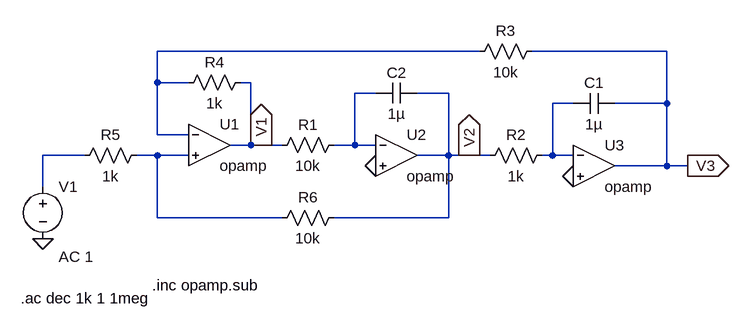
[diagram p0: schematic EJE8.asc]
EJE8.asc, the LTspice schematic file:
Version 4
SHEET 1 952 680
WIRE 544 -32 48 -32
WIRE 832 -32 624 -32
WIRE 48 16 48 -32
WIRE 96 16 48 16
WIRE 192 16 176 16
WIRE 384 32 352 32
WIRE 496 32 448 32
WIRE 688 48 656 48
WIRE 832 48 832 -32
WIRE 832 48 752 48
WIRE 48 96 48 16
WIRE 96 96 48 96
WIRE 192 112 192 16
WIRE 192 112 160 112
WIRE 208 112 192 112
WIRE 240 112 208 112
WIRE 352 112 352 32
WIRE 352 112 320 112
WIRE 384 112 352 112
WIRE -64 128 -128 128
WIRE 48 128 16 128
WIRE 96 128 48 128
WIRE 496 128 496 32
WIRE 496 128 448 128
WIRE 528 128 496 128
WIRE 560 128 528 128
WIRE 656 128 656 48
WIRE 656 128 640 128
WIRE 688 128 656 128
WIRE 832 144 832 48
WIRE 832 144 752 144
WIRE 864 144 832 144
WIRE -128 176 -128 128
WIRE 48 224 48 128
WIRE 240 224 48 224
WIRE 496 224 496 128
WIRE 496 224 320 224
FLAG 384 144 0
FLAG 688 160 0
FLAG 208 112 V1
IOPIN 208 112 Out
FLAG 528 128 V2
IOPIN 528 128 Out
FLAG 864 144 V3
IOPIN 864 144 Out
FLAG -128 256 0
SYMBOL res 32 112 R90
WINDOW 0 0 56 VBottom 2
WINDOW 3 32 56 VTop 2
SYMATTR InstName R5
SYMATTR Value 1k
SYMBOL OpAmps\\opamp 128 48 R0
SYMATTR InstName U1
SYMBOL res 192 0 R90
WINDOW 0 0 56 VBottom 2
WINDOW 3 32 56 VTop 2
SYMATTR InstName R4
SYMATTR Value 1k
SYMBOL res 336 96 R90
WINDOW 0 0 56 VBottom 2
WINDOW 3 32 56 VTop 2
SYMATTR InstName R1
SYMATTR Value 10k
SYMBOL OpAmps\\opamp 416 64 R0
SYMATTR InstName U2
SYMBOL cap 448 16 R90
WINDOW 0 0 32 VBottom 2
WINDOW 3 32 32 VTop 2
SYMATTR InstName C2
SYMATTR Value 1µ
SYMBOL res 336 208 R90
WINDOW 0 0 56 VBottom 2
WINDOW 3 32 56 VTop 2
SYMATTR InstName R6
SYMATTR Value 10k
SYMBOL res 656 112 R90
WINDOW 0 0 56 VBottom 2
WINDOW 3 32 56 VTop 2
SYMATTR InstName R2
SYMATTR Value 1k
SYMBOL OpAmps\\opamp 720 80 R0
SYMATTR InstName U3
SYMBOL cap 752 32 R90
WINDOW 0 0 32 VBottom 2
WINDOW 3 32 32 VTop 2
SYMATTR InstName C1
SYMATTR Value 1µ
SYMBOL res 640 -48 R90
WINDOW 0 0 56 VBottom 2
WINDOW 3 32 56 VTop 2
SYMATTR InstName R3
SYMATTR Value 10k
SYMBOL voltage -128 160 R0
WINDOW 123 24 124 Left 2
WINDOW 39 0 0 Left 0
SYMATTR InstName V1
SYMATTR Value ""
SYMATTR Value2 AC 1
TEXT 40 328 Left 2 !.inc opamp.sub
TEXT -162 348 Left 2 !.ac dec 1k 1 1meg

The netlist it stands for:
* EJE8.asc
R5 N005 N004 1k
XU1 N001 N005 V1 opamp Aol=100K GBW=10Meg  ; pins invin noninvin out
R4 V1 N001 1k
R1 N002 V1 10k
XU2 N002 0 V2 opamp Aol=100K GBW=10Meg  ; pins invin noninvin out
C2 V2 N002 1µ
R6 V2 N005 10k
R2 N003 V2 1k
XU3 N003 0 V3 opamp Aol=100K GBW=10Meg  ; pins invin noninvin out
C1 V3 N003 1µ
R3 V3 N001 10k
V1 N004 0 AC 1
.inc opamp.sub
.ac dec 1k 1 1meg
.backanno
.end